# EAGLE design geiger-board (EAGLE 7.6.0)
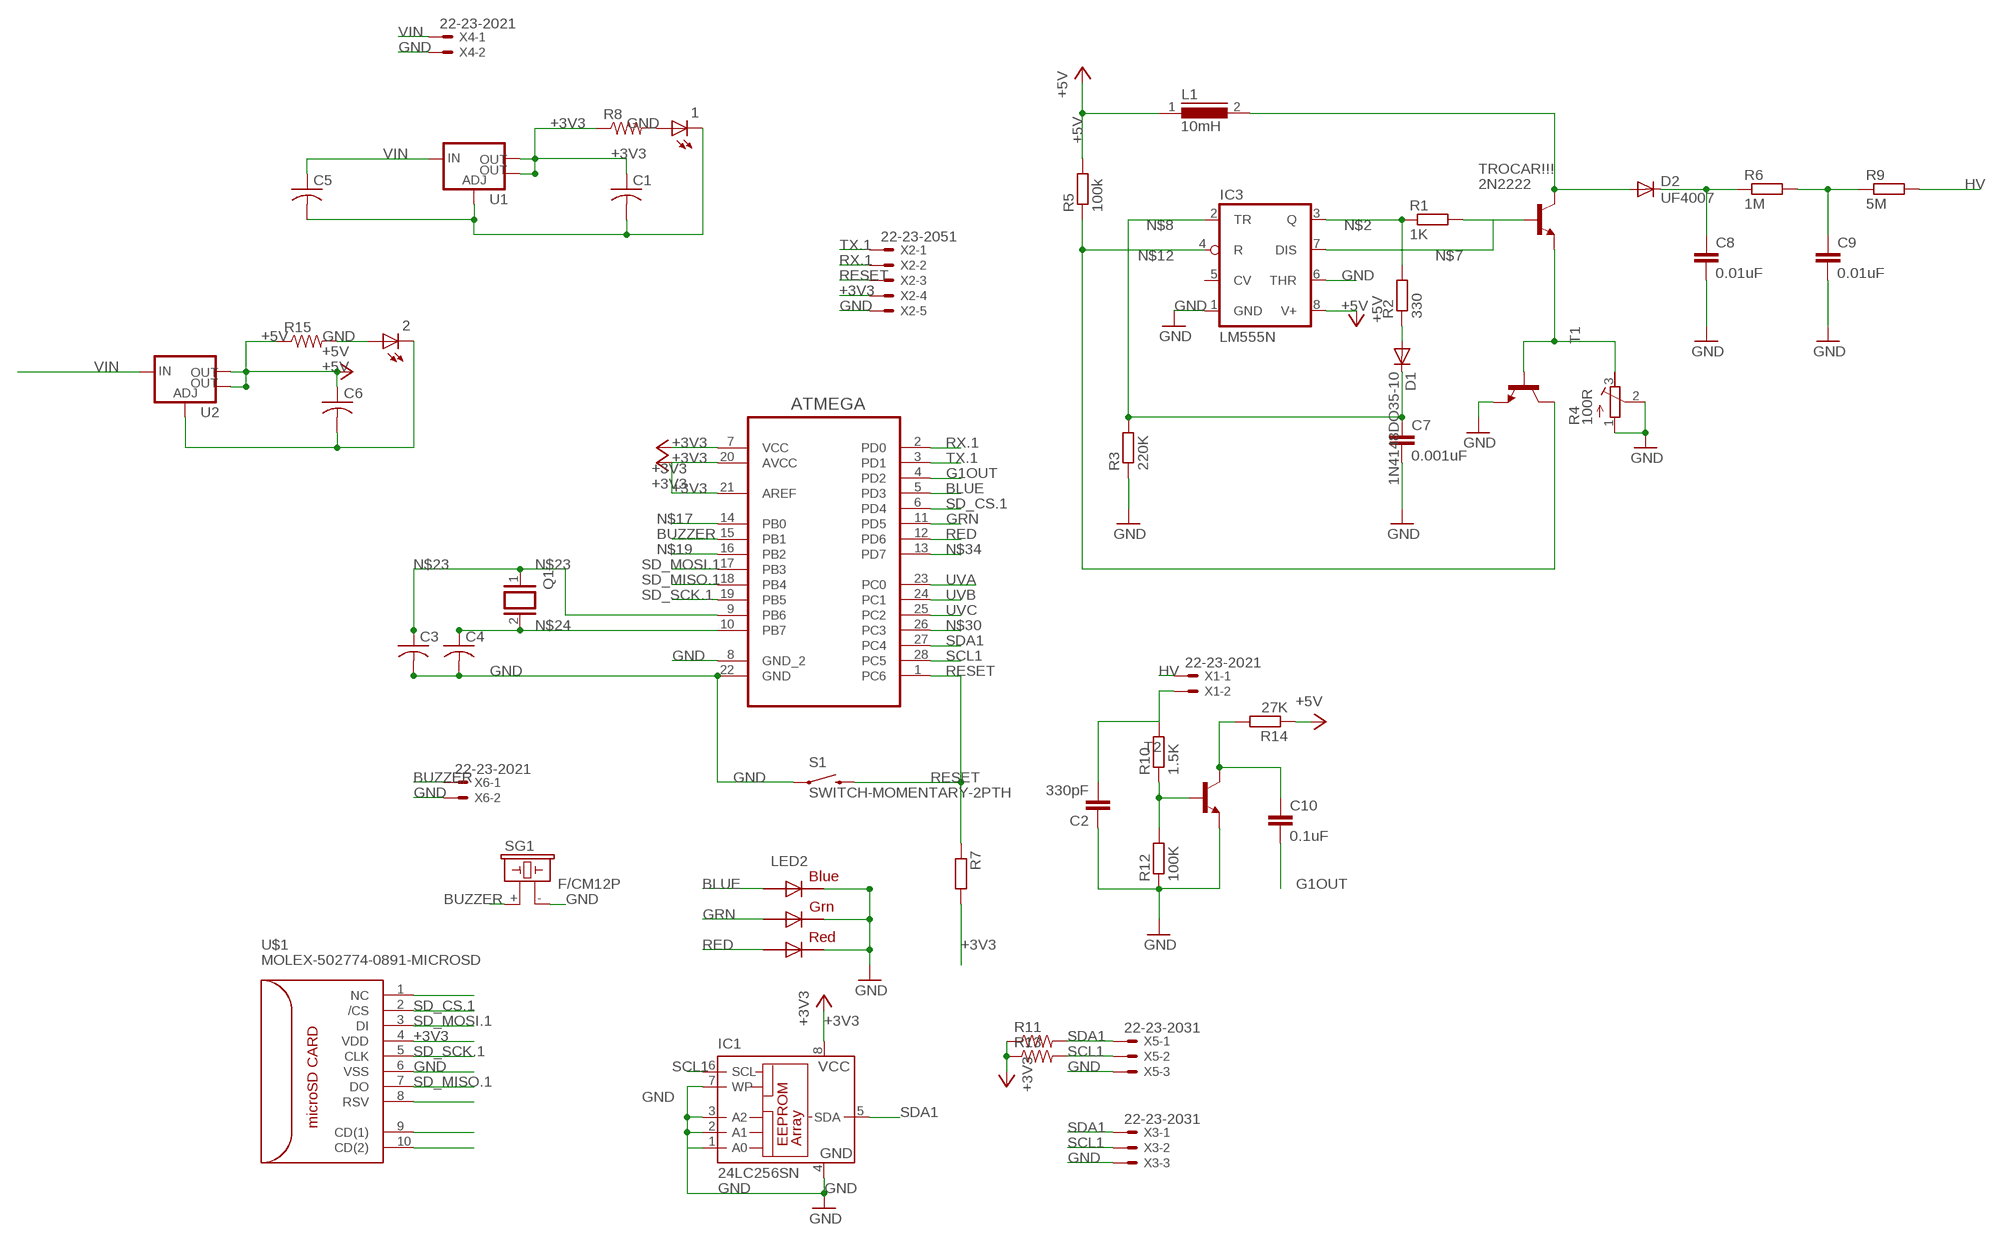
[diagram p0: schematic, sheet 1]

## Parts
1  LEDSMT1206  [1206]
2  LEDSMT1206  [1206]
ATMEGA  ATMEGA328P-PU  [DIP254P762X457-28]
C1  C-USC1210K  [C1210K]
C2  330pF  C5/4.5  [C5B4.5]
C3  C-USC1210K  [C1210K]
C4  C-USC1210K  [C1210K]
C5  C-USC1210K  [C1210K]
C6  C-USC1210K  [C1210K]
C7  0.001uF  C5/4.5  [C5B4.5]
C8  0.01uF  C5/4.5  [C5B4.5]
C9  0.01uF  C5/4.5  [C5B4.5]
C10  0.1uF  C5/4.5  [C5B4.5]
D1  1N4148DO35-10  [DO35-10]
D2  UF4007  1N4148DO35-10  [DO35-10]
IC1  24LC256SN  [SO-08]
IC3  LM555N  [DIL08-ROUND]
L1  10mH  82114R  [82114R]
LED2  RGBLED5050  [RGBLED5050]
Q1  XTAL/S  [QS]
R1  1K  R0207/10  [0207/10]
R2  330  R0207/10  [0207/10]
R3  220K  R0207/10  [0207/10]
R4  100R  R-TRIMM3296W  [RTRIM3296W]
R5  100k  R0207/10  [0207/10]
R6  1M  R0207/10  [0207/10]
R7  R-EU_0207/10  [0207/10]
R8  R-US_M1206  [M1206]
R9  5M  R0207/10  [0207/10]
R10  1.5K  R0207/10  [0207/10]
R11  R-US_R1206  [R1206]
R12  100K  R0207/10  [0207/10]
R13  R-US_R1206  [R1206]
R14  27K  R0207/10  [0207/10]
R15  R-US_M1206  [M1206]
S1  SWITCH-MOMENTARY-2PTH  [TACTILE-PTH]
SG1  F/CM12P  [F/CM12P]
T1  2N4401-NPN-TO92-EBC  [TO92-EBC]
T2  2N4401-NPN-TO92-EBC  [TO92-EBC]
TROCAR!!!  2N2222  [TO92-EBC-OVAL]
U1  V_REG_LM1117SOT223  [SOT223]
U2  V_REG_LM1117SOT223  [SOT223]
U$1  MOLEX-502774-0891-MICROSD  [MOLEX-502774-0891-MICROSD]
X1  22-23-2021  [22-23-2021]
X2  22-23-2051  [22-23-2051]
X3  22-23-2031  [22-23-2031]
X4  22-23-2021  [22-23-2021]
X5  22-23-2031  [22-23-2031]
X6  22-23-2021  [22-23-2021]

## Nets
+3V3: ATMEGA.7(VCC) ATMEGA.20(AVCC) ATMEGA.21(AREF) C1.1 IC1.8(VCC) R7.2 R8.1 R11.1 R13.1 U1.2(OUT) U1.4(OUT) U$1.4(VDD) X2.4
+5V: C6.1 IC3.8(V+) L1.1 R5.2 R14.1 R15.1 U2.2(OUT) U2.4(OUT)
BLUE: ATMEGA.5(PD3) LED2.3(BLUE_A)
BUZZER: ATMEGA.15(PB1) SG1.+ X6.1
G1OUT: ATMEGA.4(PD2) C10.2
GND: 1.C 2.C ATMEGA.8(GND_2) ATMEGA.22(GND) C1.2 C2.1 C3.2 C4.2 C5.2 C6.2 C7.2 C8.2 C9.2 IC1.1(A0) IC1.2(A1) IC1.3(A2) IC1.4(GND) IC1.7(WP) IC3.1(GND) IC3.6(THR) LED2.4(BLUE_C) LED2.5(RED_C) LED2.6(GREEN_C) R3.1 R4.1(A) R4.2(S) R12.1 S1.1 SG1.- T1.E T2.E U1.1(ADJ) U2.1(ADJ) U$1.6(VSS) X2.5 X3.3 X4.2 X5.3 X6.2
GRN: ATMEGA.11(PD5) LED2.1(GREEN_A)
HV: R9.2 X1.1
N$1: 1.A R8.2
N$2: IC3.3(Q) R1.1 R2.2
N$3: U$1.1(NC)
N$5: 2.A R15.2
N$6: D1.A R2.1
N$7: IC3.7(DIS) R1.2 TROCAR!!!.B
N$8: C7.1 D1.C IC3.2(TR) R3.2
N$9: D2.A L1.2 TROCAR!!!.C
N$11: C8.1 D2.C R6.1
N$12: IC3.4(R) R5.1 T1.C
N$15: C9.1 R6.2 R9.1
N$17: ATMEGA.14(PB0)
N$18: C2.2 R10.2 X1.2
N$19: ATMEGA.16(PB2)
N$20: R4.3(E) T1.B TROCAR!!!.E
N$22: R10.1 R12.2 T2.B
N$23: ATMEGA.9(PB6) C3.1 Q1.1
N$24: ATMEGA.10(PB7) C4.1 Q1.2
N$27: C10.1 R14.2 T2.C
N$29: U$1.8(RSV)
N$30: ATMEGA.26(PC3)
N$31: U$1.9(CD(1))
N$32: U$1.10(CD(2))
N$34: ATMEGA.13(PD7)
RED: ATMEGA.12(PD6) LED2.2(RED_A)
RESET: ATMEGA.1(PC6) R7.1 S1.3 X2.3
RX.1: ATMEGA.2(PD0) X2.2
SCL1: ATMEGA.28(PC5) IC1.6(SCL) R13.2 X3.2 X5.2
SD_CS.1: ATMEGA.6(PD4) U$1.2(/CS)
SD_MISO.1: ATMEGA.18(PB4) U$1.7(DO)
SD_MOSI.1: ATMEGA.17(PB3) U$1.3(DI)
SD_SCK.1: ATMEGA.19(PB5) U$1.5(CLK)
SDA1: ATMEGA.27(PC4) IC1.5(SDA) R11.2 X3.1 X5.1
TX.1: ATMEGA.3(PD1) X2.1
UVA: ATMEGA.23(PC0)
UVB: ATMEGA.24(PC1)
UVC: ATMEGA.25(PC2)
VIN: C5.1 U1.3(IN) U2.3(IN) X4.1
Unconnected: IC3.5(CV)

## Library data of the parts
1 2 = adafruit:LED: LED OSRAM: - CHIPLED LG R971, LG N971, LY N971, LG Q971, LY Q971, LO R971, LY R971 LH N974, LH R974 LS Q976, LO Q976, LY Q976 LO Q996 - Hyper CHIPLED LW Q18S LB Q993, LB Q99A, LB R99A - SideLED LS A670, LO A670, LY A670, LG A670, LP A670 LB A673, LV A673, LT A673, LW A673 LH A674 LY A675 LS A676, LA A676, LO A676, LY A676, LW A676 LS A679, LY A679, LG A679 - Hyper Micro SIDELED® LS Y876, LA Y876, LO Y876, LY Y876 LT Y87S - SmartLED LW L88C, LW L88S LB L89C, LB L89S, LG L890 LS L89K, LO L89K, LY L89K LS L896, LA L896, LO L896, LY L896 - TOPLED LS T670, LO T670, LY T670, LG T670, LP T670 LSG T670, LSP T670, LSY T670, LOP T670, LYG T670 LG T671, LOG T671, LSG T671 LB T673, LV T673, LT T673, LW T673 LH T674 LS T676, LA T676, LO T676, LY T676, LB T676, LH T676, LSB T676, LW T676 LB T67C, LV T67C, LT T67C, LS T67K, LO T67K, LY T67K, LW E67C LS E67B, LA E67B, LO E67B, LY E67B, LB E67C, LV E67C, LT E67C LW T67C LS T679, LY T679, LG T679 LS T770, LO T770, LY T770, LG T770, LP T770 LB T773, LV T773, LT T773, LW T773 LH T774 LS E675, LA E675, LY E675, LS T675 LS T776, LA T776, LO T776, LY T776, LB T776 LHGB T686 LT T68C, LB T68C - Hyper Mini TOPLED® LB M676 - Mini TOPLED Santana® LG M470 LS M47K, LO M47K, LY M47K Source: http://www.osram.convergy.de/
ATMEGA = Atmel_By_element14_Batch_1-00:ATMEGA328P-PU: 8-bit Microcontroller with In-System Programmable Flash; MPN: ATMEGA328P-PU; OC_FARNELL: 1715487; OC_NEWARK: 15R0268; PACKAGE: PDIP-28; SUPPLIER: Atmel
C1 C3-C6 = adafruit:C-US: CAPACITOR, American symbol
C2 C7-C10 = capacitor-wima:C: CAPACITOR naming: grid - package width
D1 D2 = diode:1N4148: DIODE high speed (Philips)
IC1 = microchip:24*: Serial EEPROM I2C; MF: MICROCHIP; MPN: 24LC256-I/SN; OC_FARNELL: 9757996; OC_NEWARK: 27C9144
IC3 = adafruit:*555: TIMER Changed DIP package to have round (not oval) pin pads http://www.ladyada.net/library/pcb/eaglelibrary.html
L1 = inductors:82114R: INDUCTOR
LED2 = adafruit:RGBLED: For 5050 RGB LEDs, the order of the LEDs may vary from one manufacturer to another!
Q1 = special:XTAL/S: CRYSTAL
R1-R3 R5 R6 R9 R10 R12 R14 = eagle-ltspice:R: RESISTOR, European symbol; SPICEMODEL: NONE; SPICEPREFIX: R
R4 = rcl:R-TRIMM: Trimm resistor
R7 = resistor:R-EU_: RESISTOR, European symbol
R8 R11 R13 R15 = adafruit:R-US_: RESISTOR, American symbol
S1 = SparkFun-Electromechanical:SWITCH-MOMENTARY-2: Various NO switches- pushbuttons, reed, etc; PROD_ID: SWCH-08441
SG1 = buzzer:F/CM12P: BUZZER Source: Buerklin; OC_FARNELL: unknown; OC_NEWARK: unknown
T1 T2 = transistor-neu-to92:*-NPN-: NPN Transistror
TROCAR!!! = adafruit:2N2222: NPN TRANSISTOR Big oval pads
U1 U2 = SparkFun-PowerIC:V_REG_LM1117: Voltage Regulator LM1117 Standard adjustable voltage regulator but in SMD form. Spark Fun Electronics SKU : COM-00595; PROD_ID: VREG-08170
U$1 = Ava:MOLEX-502774-0891-MICROSD; FARNELL: 2064063
X1 X4 X6 = con-molex:22-23-2021: .100" (2.54mm) Center Header - 2 Pin; MF: MOLEX; MPN: 22-23-2021; OC_FARNELL: 1462926; OC_NEWARK: 25C3832
X2 = con-molex:22-23-2051: .100" (2.54mm) Center Header - 5 Pin; MF: MOLEX; MPN: 22-23-2051; OC_FARNELL: 1462952; OC_NEWARK: 38C9178
X3 X5 = con-molex:22-23-2031: .100" (2.54mm) Center Header - 3 Pin; MF: MOLEX; MPN: 22-23-2031; OC_FARNELL: 1462950; OC_NEWARK: 30C0862

## Board
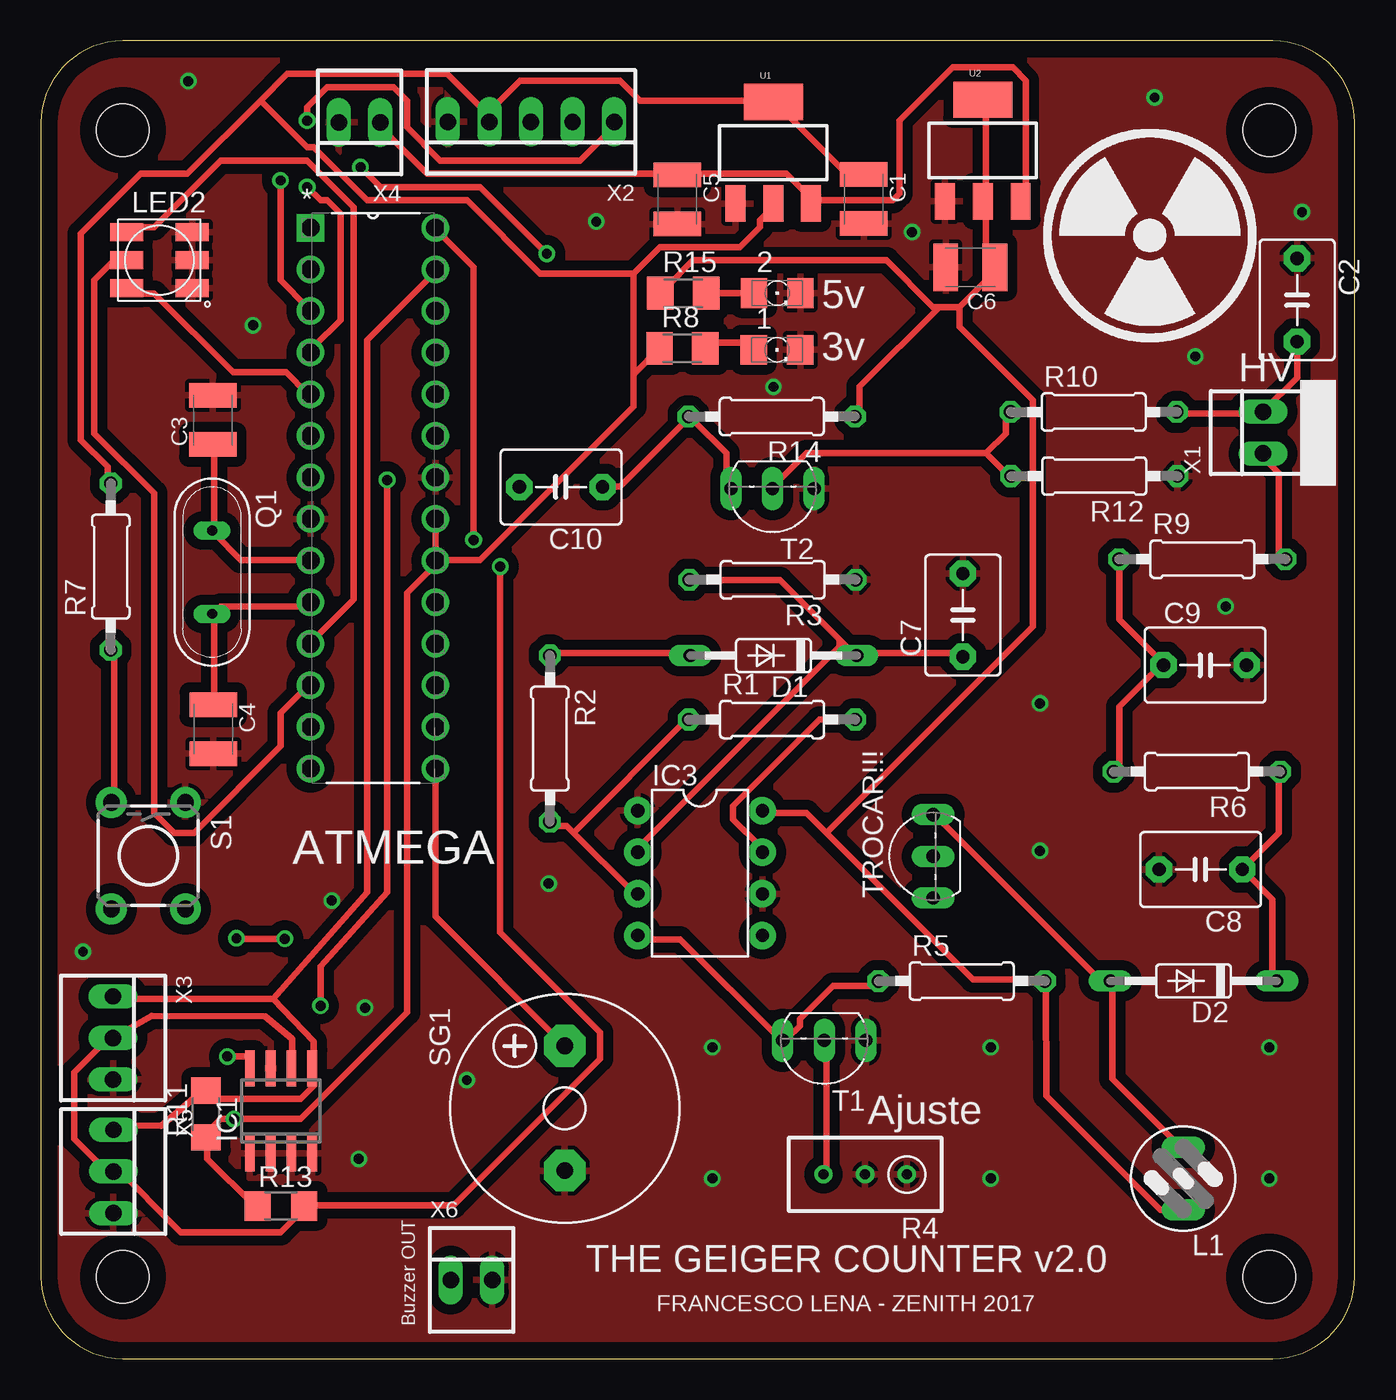
[diagram p1: board, top side]
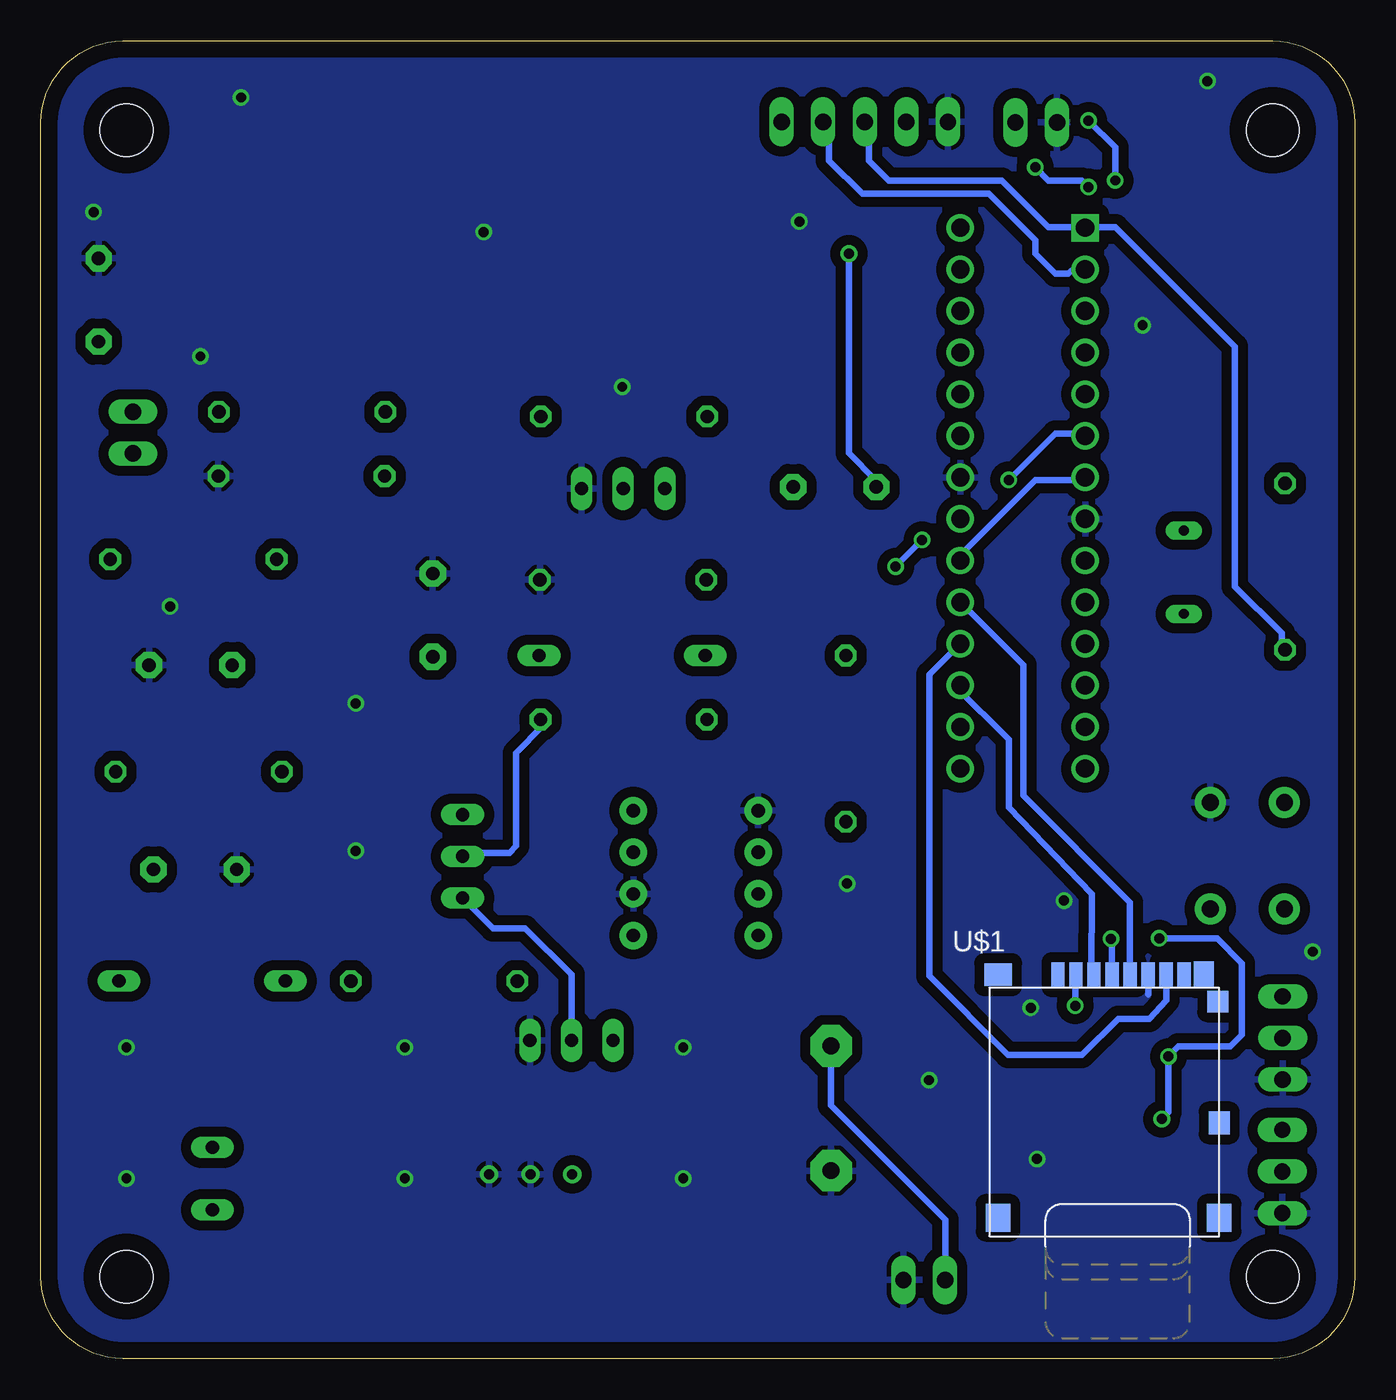
[diagram p2: board, bottom side, seen from below]

Size 80.22 x 80.45 mm. Coordinates in mm from the lower left corner, seen from the top.
Outline: 0,75.45 0,5 arc90 5,0 75.22,0 arc90 80.22,5 80.22,75.45 arc90 75.22,80.45 5,80.45 arc90 0,75.45
Copper layers (1*16): Top 0.035mm / dielectric 1.5mm / Bottom 0.035mm
Design rules "default *": minimum track width 16mil, minimum drill 24mil, track to track 16mil, track to pad 16mil, pad to pad 12mil, via to via 12mil, smd to smd 8mil, copper to edge 40mil, drill to drill 8mil, minimum pad ring 10mil, minimum via ring 8mil, stop-mask expansion 4mil, vias tented up to drill 100mil, thermal gap 10mil
Holes 3.2 mm at 5,5 5,75 75,75 75,5

### Footprints (pad centres in the part's own frame; a part is rotated, then mirrored left to right if it is on the bottom)
1206 = smd 1.6 x 1.803: A -1.422,0; C 1.422,0
DIP254P762X457-28 = drill 1.118 square: 1 -7.62,33.02 | drill 1.118: 2 -7.62,30.48; 3 -7.62,27.94; 4 -7.62,25.4; 5 -7.62,22.86; 6 -7.62,20.32; 7 -7.62,17.78; 8 -7.62,15.24; 9 -7.62,12.7; 10 -7.62,10.16; 11 -7.62,7.62; 12 -7.62,5.08; 13 -7.62,2.54; 14 -7.62,0; 15 0,0; 16 0,2.54; 17 0,5.08; 18 0,7.62; 19 0,10.16; 20 0,12.7; 21 0,15.24; 22 0,17.78; 23 0,20.32; 24 0,22.86; 25 0,25.4; 26 0,27.94; 27 0,30.48; 28 0,33.02
C1210K = smd 1.5 x 2.9: 1 -1.5,0; 2 1.5,0
C5B4.5 = drill 0.813 pad 1.6 octagon: 1 -2.54,0; 2 2.54,0
DO35-10 = drill 0.813 long: A 5.08,0; C -5.08,0
SO-08 = smd 0.6 x 2.2: 1 -1.905,-2.6; 2 -0.635,-2.6; 3 0.635,-2.6; 4 1.905,-2.6; 5 1.905,2.6; 6 0.635,2.6; 7 -0.635,2.6; 8 -1.905,2.6
DIL08-ROUND = drill 0.813 pad 1.676: 1 -3.81,-3.81; 2 -1.27,-3.81; 3 1.27,-3.81; 4 3.81,-3.81; 5 3.81,3.81; 6 1.27,3.81; 7 -1.27,3.81; 8 -3.81,3.81
82114R = drill 0.813 long: 1 0,1.905; 2 0,-1.905
RGBLED5050 = smd 2 x 1.1: 1 -2,1.7; 2 -2,0; 3 -2,-1.7; 4 2,-1.7; 5 2,0; 6 2,1.7
QS = drill 0.61 long: 1 -2.54,0; 2 2.54,0
0207/10 = drill 0.813 octagon: 1 -5.08,0; 2 5.08,0
RTRIM3296W = drill 0.61: 1 0,-2.54; 2 0,0; 3 0,2.54
M1206 = smd 1.6 x 2: 1 -1.4,0; 2 1.4,0
R1206 = smd 1.6 x 1.803: 1 -1.422,0; 2 1.422,0
TACTILE-PTH = drill 1.016 pad 1.88: 1 -3.251,2.261; 2 3.251,2.261; 3 -3.251,-2.261; 4 3.251,-2.261
F/CM12P = drill 1.016 pad 2.54 octagon: + 3.81,0; - -3.81,0
TO92-EBC = drill 0.813 long: B 0,-1.27; C 2.54,-1.27; E -2.54,-1.27
TO92-EBC-OVAL = drill 0.813 long: B 0,-1.27; C 2.54,-1.27; E -2.54,-1.27
SOT223 = smd 1.219 x 2.235: 1 -2.311,-3.099; 2 0,-3.099; 3 2.311,-3.099 | smd 3.6 x 2.2: 4 0,3.099
MOLEX-502774-0891-MICROSD = smd 0.8 x 1.5: 1 -3.3,8.2; 2 -2.2,8.2; 3 -1.1,8.2; 4 0,8.2; 5 1.1,8.2; 6 2.2,8.2; 7 3.3,8.2; 8 4.4,8.2 | smd 1.29 x 1.3: 9 6.455,6.55 | smd 1.29 x 1.4: 10 6.54,-0.85 | smd 1.5 x 1.7: 11 6.54,-6.65; 12 -6.96,-6.65 | smd 1.7 x 1.4: 14 -6.96,8.2 | smd 1.2 x 1.6: 15 5.6,8.2
22-23-2021 = drill 1 long: 1 -1.27,0; 2 1.27,0
22-23-2051 = drill 1 long: 1 -5.08,0; 2 -2.54,0; 3 0,0; 4 2.54,0; 5 5.08,0
22-23-2031 = drill 1 long: 1 -2.54,0; 2 0,0; 3 2.54,0

### Placement (x,y rotation side)
1  44.94,61.59 0 top
2  44.96,65.05 0 top
ATMEGA  24.08,36.03 0 top
C1  50.24,70.8 270 top
C2  76.7,64.64 270 top
C3  10.49,57.31 90 top
C4  10.52,38.43 270 top
C5  38.86,70.78 270 top
C6  56.74,66.62 180 top
C7  56.3,45.39 90 top
C8  70.81,29.86 180 top
C9  71.08,42.34 0 top
C10  31.75,53.22 180 top
D1  44.73,42.92 180 top
D2  70.37,23.06 180 top
IC1  14.66,15.13 0 top
IC3  40.24,29.64 270 top
L1  69.75,10.99 180 top
LED2  7.23,67.07 0 top
Q1  10.44,48.01 270 top
R1  44.64,39.02 0 top
R2  31.07,37.85 270 top
R3  44.67,47.55 180 top
R4  50.32,11.25 90 top
R5  56.22,23.05 0 top
R6  70.58,35.84 180 top
R7  4.26,48.36 90 top
R8  39.16,61.68 0 top
R9  70.91,48.81 0 top
R10  64.28,57.8 0 top
R11  10.08,14.94 90 top
R12  64.31,53.88 180 top
R13  14.66,9.32 0 top
R14  44.62,57.52 180 top
R15  39.22,65.05 0 top
S1  6.56,30.7 270 top
SG1  31.98,15.28 90 top
T1  47.83,18.16 180 top
T2  44.67,51.85 180 top
TROCAR!!!  53.21,30.67 90 top
U1  44.72,73.63 0 top
U2  57.51,73.76 0 top
U$1  14.82,15.24 0 bottom
X1  74.61,56.54 90 top
X2  29.92,75.51 180 top
X3  4.4,19.57 270 top
X4  19.45,75.47 180 top
X5  4.43,11.42 270 top
X6  26.29,4.8 0 top

### Tracks (layer width: path | path; a pad name or v marks a point on that pad's centre or on a via)
+3V3  (via drill 0.6, 0.61)
  Top 0.406: C1.1 49.99,72.34 49.17,72.34 45.11,76.4 U1.4 44.7,76.81 36.58,76.81 35.36,78.03 29.26,78.03 27.23,76 | 13.41,76.81 15.04,78.44 24.79,78.44 27.23,76 | 13.41,76.81 8.94,72.34 6.1,72.34 2.44,68.68 2.44,56.08 4.06,54.46 4.06,53.65 R7.2 | 27.23,76 27.64,75.59 X2.4 27.23,76 | R13.1 13.01,9.35 10.16,12.19 10.16,13.41 R11.1 10.16,13.82 10.97,14.63 v11.79,14.63 15.85,14.63 22.35,21.13 22.35,46.74 23.98,48.36 ATMEGA.20 | ATMEGA.20 24.38,48.77 26.82,48.77 36.17,58.12 36.17,60.09 | 36.17,66.24 37.8,67.87 42.67,67.87 43.89,69.09 43.89,69.49 44.7,70.31 U1.2 | 36.17,60.09 36.17,66.24 | 13.41,76.81 16.26,73.97 16.66,73.97 19.91,70.71 26.01,70.71 30.48,66.24 36.17,66.24 | v11.94,25.65 11.96,25.63 v14.88,25.63 | ATMEGA.21 ATMEGA.20 | IC1.8 12.76,18.44 v11.38,18.44 | 36.17,60.09 R8.1
  Bottom 0.406: v11.79,14.63 11.38,15.04 v11.38,18.44 10.77,19.05 7.59,19.05 6.88,19.76 6.88,24.13 8.41,25.65 v11.94,25.65 | ATMEGA.7 16.66,53.65 19.51,53.65 24.38,48.77 ATMEGA.20 | v14.88,25.63 14.82,25.56 U$1.4
+5V
  Top 0.406: 56.08,64.21 54.86,64.21 | 54.86,64.21 54.46,64.21 51.61,67.06 39.83,67.06 38.2,65.43 R15.1 | 56.08,64.21 58.12,66.24 C6.1 58.12,66.65 57.71,67.06 57.71,70.31 U2.2 57.71,70.71 57.71,76.81 U2.4 | 54.86,64.21 49.99,59.33 49.99,57.71 R14.1 | 47.95,32.11 56.9,23.16 60.96,23.16 R5.2 61.37,22.76 61.39,16.03 68.34,9.08 L1.1 | 47.95,32.11 46.74,33.33 44.3,33.33 IC3.8 | 56.08,64.21 56.08,62.99 60.55,58.52 60.55,44.7 47.95,32.11
BLUE
  Top 0.406: LED2.3 5.28,65.02 6.91,65.02 11.73,60.22 14.99,60.22 16.26,58.93 ATMEGA.5
BUZZER
  Top 0.406: ATMEGA.15 24.08,26.99 SG1.+
  Bottom 0.406: SG1.+ 31.98,15.47 24.99,8.48 24.99,4.83 X6.1
G1OUT  (via drill 0.61)
  Top 0.406: v30.89,67.46 26.82,71.53 20.73,71.53 v19.51,72.75 | v16.26,71.53 17.07,70.71 17.48,70.71 18.29,69.9 18.29,63.4 16.66,61.77 ATMEGA.4
  Bottom 0.406: v30.89,67.46 30.89,55.27 29.26,53.65 29.26,53.24 C10.2 | v19.51,72.75 18.69,71.93 16.66,71.93 v16.26,71.53
GND  (via drill 0.6, 0.61)
  Bottom 0.406: U$1.6 12.6,23.16 12.6,22.35 12.61,22.23
  other vias: 44.73,59.33 33.91,69.42 53.19,68.78 19.41,12.19 19.79,21.41 17.75,27.97 2.57,24.84 12.95,63.09 75,11 75,19 72.34,45.92 61,31 61,40 58,19 58,11 41,11 41,19 26,17 31,29 70.48,61.19 77,70 68,77 9,78
  pour Top (isolate 0.61): 0.5,75.5 0.5,5.5 arc90 5.5,0.5 75,0.5 arc90 80,5.5 80,75 arc90 75,80 4.5,80 arc90
  pour Bottom (isolate 0.61): 0.5,75.5 0.5,5.5 arc90 5.5,0.5 75,0.5 arc90 80,5.5 80,75 arc90 75,80 4.5,80 arc90
GRN
  Top 0.406: LED2.1 5.28,69.09 6.91,69.09 10.97,73.15 16.26,73.15 19.1,70.31 19.1,46.33 16.66,43.89 ATMEGA.11
HV
  Top 0.406: R9.2 75.59,49.17 75.59,54.05 74.78,54.86 X1.1
N$1
  Top 0.406: 41.06,62.18 40.92,62.05 | 40.92,62.05 R8.2 | 1.A 43.07,62.05 40.92,62.05
N$2
  Top 0.406: 32.51,32.11 36.17,28.45 IC3.3 | 32.51,32.11 32.11,32.51 31.29,32.51 R2.2 | 32.51,32.11 39.42,39.01 R1.1
N$5
  Top 0.406: 40.64,65.02 R15.2 2.A
N$6
  Top 0.406: D1.A 39.42,43.08 31.29,43.08 R2.1
N$7
  Top 0.406: IC3.7 43.89,31.29 42.27,32.92 42.27,33.73 47.55,39.01 49.58,39.01 R1.2
  Bottom 0.406: TROCAR!!!.B 54.46,30.89 51.61,30.89 51.21,31.29 51.21,36.98 49.58,38.61 49.58,39.01 R1.2
N$8
  Top 0.406: 48.77,43.89 49.58,43.08 D1.C 49.99,43.08 56.08,43.08 C7.1 | 48.77,43.89 45.11,47.55 39.83,47.55 R3.2 | 48.77,43.89 48.77,43.48 36.58,31.29 IC3.2
N$9
  Top 0.406: TROCAR!!!.C 54.86,32.92 65.02,22.76 D2.A 65.43,22.76 65.43,17.07 69.61,12.89 L1.2
N$11
  Top 0.406: D2.C 75.18,23.16 75.18,28.04 73.56,29.67 C8.1 73.56,30.07 75.59,32.11 75.59,35.76 R6.1
N$12
  Top 0.406: R5.1 50.8,22.76 48.36,22.76 46.33,20.73 46.33,20.32 45.52,19.51 T1.C 45.11,19.51 39.01,25.6 36.58,25.6 IC3.4
N$15
  Top 0.406: R6.2 65.84,36.17 65.84,39.83 68.28,42.27 C9.1 68.28,42.67 65.84,45.11 65.84,48.77 R9.1
N$18
  Top 0.406: R10.2 69.49,57.71 74.37,57.71 X1.2 76.7,59.9 C2.2
N$20
  Top 0.406: R4.3 47.95,11.38 47.95,19.1 T1.B
  Bottom 0.406: T1.B 47.83,23.44 50.65,26.26 52.61,26.26 TROCAR!!!.E
N$22
  Top 0.406: 57.71,55.27 46.74,55.27 44.7,53.24 T2.B | 57.71,55.27 58.93,54.05 R12.2 | 57.71,55.27 58.93,56.49 58.93,57.71 R10.1
N$23
  Top 0.406: C3.1 10.57,55.68 10.57,50.8 Q1.1 10.57,50.39 12.19,48.77 16.26,48.77 ATMEGA.9
N$24
  Top 0.406: C4.1 10.57,40.23 10.57,45.11 Q1.2 10.57,45.52 10.97,45.92 16.26,45.92 ATMEGA.10
N$27
  Top 0.406: T2.C 41.86,53.24 41.86,55.27 39.83,57.3 R14.2 39.42,57.3 35.36,53.24 34.54,53.24 C10.1
RED
  Top 0.406: LED2.2 4.88,67.06 4.47,67.06 3.25,65.84 3.25,56.49 6.91,52.83 6.91,33.33 8.13,32.11 9.35,32.11 14.63,37.39 14.63,39.42 16.26,41.05 ATMEGA.12
RESET
  Top 0.406: R7.1 4.47,43.08 4.47,34.14 S1.3
  Bottom 0.406: X2.3 29.67,75.18 29.67,73.15 28.45,71.93 21.54,71.93 18.69,69.09 16.66,69.09 ATMEGA.1 16.26,69.09 14.63,69.09 7.32,61.77 7.32,47.14 4.47,44.3 4.47,43.48 R7.1
RX.1
  Bottom 0.406: X2.2 32.11,75.18 32.11,73.15 30.07,71.12 22.35,71.12 19.51,68.28 19.51,67.46 18.29,66.24 17.48,66.24 17.07,66.65 16.66,66.65 ATMEGA.2
SCL1  (via drill 0.61)
  Top 0.406: IC1.6 15.34,17.83 15.34,19.53 13.69,20.9 6.76,20.93 X3.2 4.06,19.51 2.03,17.48 2.03,13.41 4.06,11.38 X5.2 4.47,11.79 8.53,7.72 14.63,7.72 15.85,8.94 R13.2 16.26,9.35 25.2,9.35 34.14,18.29 34.14,19.91 28.04,26.01 v28.04,48.36 | v26.42,49.99 26.42,66.65 24.38,68.68 ATMEGA.28
  Bottom 0.406: v28.04,48.36 v26.42,49.99
SD_CS.1  (via drill 0.61)
  Top 0.406: v17.07,21.54 17.07,23.95 21.13,28.45 v21.13,53.65
  Bottom 0.406: v17.07,21.54 17.07,23.16 U$1.2 | v21.13,53.65 18.29,56.49 16.66,56.49 ATMEGA.6
SD_MISO.1
  Bottom 0.406: ATMEGA.18 25.96,41.77 25.96,23.37 21.18,18.54 16.66,18.54 14.43,20.75 12.55,20.75 11.52,21.86 U$1.7
SD_MOSI.1
  Bottom 0.406: U$1.3 16.08,23.57 16.05,28.37 21.11,33.66 21.13,37.8 24.38,41.05 ATMEGA.17
SD_SCK.1
  Bottom 0.406: ATMEGA.19 20.24,42.35 20.24,34.37 13.72,27.84 U$1.5
SDA1
  Top 0.406: X5.1 4.47,14.22 7.34,14.2 9.75,16.26 R11.2 10.16,16.26 10.57,15.85 15.85,15.85 16.66,16.66 16.66,17.48 IC1.5 16.66,17.88 16.66,19.38 14.17,21.95 | 14.17,21.95 4.47,21.95 X3.1 | 14.17,21.95 19.91,28.45 19.91,62.18 23.98,66.24 ATMEGA.27
TX.1  (via drill 0.61)
  Top 0.406: v16.26,75.59 16.26,76.4 17.48,77.62 21.54,77.62 22.35,76.81 22.35,75.18 24.38,73.15 32.92,73.15 34.95,75.18 X2.1 | v14.63,71.93 14.63,65.84 16.26,64.21 ATMEGA.3
  Bottom 0.406: v16.26,75.59 14.63,73.97 v14.63,71.93
VIN
  Top 0.406: U2.3 60.15,70.71 60.15,78.03 59.33,78.84 55.68,78.84 52.43,75.59 52.43,71.12 52.02,70.71 47.14,70.71 U1.3 46.74,70.71 46.74,71.12 45.52,72.34 39.01,72.34 C5.1 38.61,72.34 23.57,72.34 20.73,75.18 X4.1

### Text on the board
tPlace: 5v | 3v | HV | Ajuste | THE GEIGER COUNTER v2.0 | FRANCESCO LENA - ZENITH 2017 | Buzzer OUT